# EAGLE design HB-WDS100-C6-O-2_Main_v2p0 (EAGLE 8.7.1)
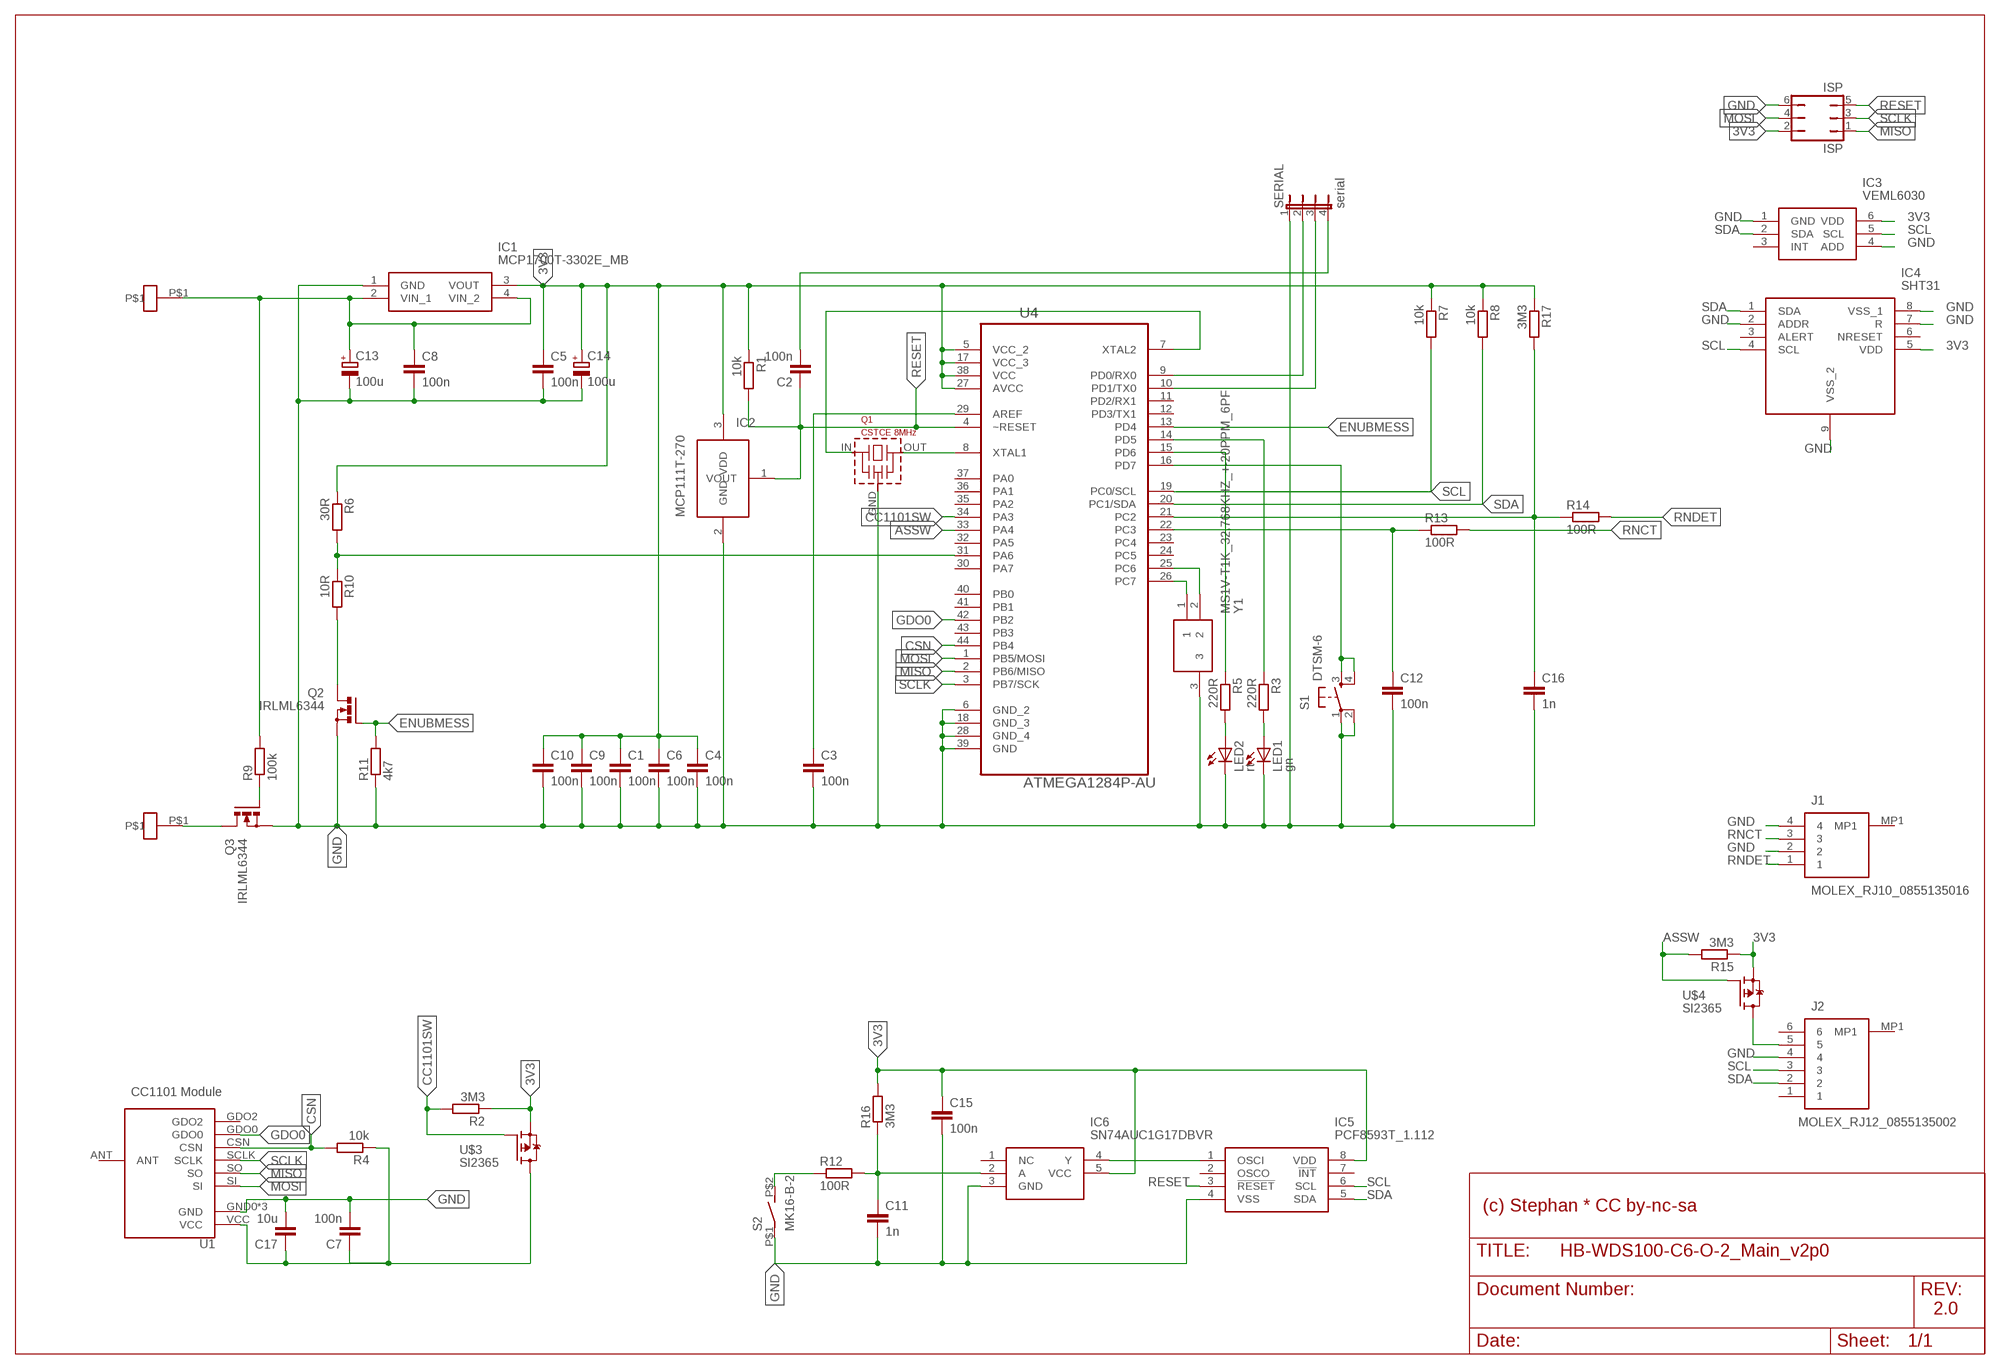
[diagram p0: schematic, sheet 1]

## Parts
C1  100n  C-EUC0805K  [C0805K]
C2  100n  C-EUC0805K  [C0805K]
C3  100n  C-EUC0805K  [C0805K]
C4  100n  C-EUC0805K  [C0805K]
C5  100n  C-EUC0805K  [C0805K]
C6  100n  C-EUC0805K  [C0805K]
C7  100n  C-EUC0805K  [C0805K]
C8  100n  C-EUC0805K  [C0805K]
C9  100n  C-EUC0805K  [C0805K]
C10  100n  C-EUC0805K  [C0805K]
C11  1n  C-EUC0805K  [C0805K]
C12  100n  C-EUC0805K  [C0805K]
C13  100u  CPOL-EUCT3528  [CT3528]
C14  100u  CPOL-EUCT3528  [CT3528]
C15  100n  C-EUC0805K  [C0805K]
C16  1n  C-EUC0805K  [C0805K]
C17  10u  C-EUC0805K  [C0805K]
IC1  MCP1700T-3302E_MB  [MCP1700T-3302E/MB]
IC2  MCP111-270  MCP111T  [SOT23]
IC3  VEML6030  VEML6030-HANDSOLD  [VEML6030-HANDSOLD]
IC4  SHT31  SHT31-HANDSOLD  [SON50P250X250X90-9N-HANDSOLD]
IC5  PCF8593T_1.112  [SOIC127P600X175-8N]
IC6  SN74AUC1G17DBVR  [SOT95P280X145-5N]
ISP  ISP  JP3Q  [JP3Q]
J1  MOLEX_RJ10_0855135016  [MOLEX_RJ10_0855135016]
J2  MOLEX_RJ12_0855135002  [MOLEX_RJ12_0855135002]
LED1  gn  LEDCHIPLED_0805  [CHIPLED_0805]
LED2  rt  LEDCHIPLED_0805  [CHIPLED_0805]
Q1  CSTCE 8MHz  CSTCE  [CSTCE]
Q2  IRLML6344  [SOT-23]
Q3  IRLML6344  [SOT-23]
R1  10k  R-EU_R0805W  [R0805W]
R2  3M3  R-EU_R0805W  [R0805W]
R3  220R  R-EU_R0805W  [R0805W]
R4  10k  R-EU_R0805W  [R0805W]
R5  220R  R-EU_R0805W  [R0805W]
R6  30R  R-EU_R0805W  [R0805W]
R7  10k  R-EU_R0805W  [R0805W]
R8  10k  R-EU_R0805W  [R0805W]
R9  100k  R-EU_R0805W  [R0805W]
R10  10R  R-EU_R0805W  [R0805W]
R11  4k7  R-EU_R0805W  [R0805W]
R12  100R  R-EU_R0805W  [R0805W]
R13  100R  R-EU_R0805W  [R0805W]
R14  100R  R-EU_R0805W  [R0805W]
R15  3M3  R-EU_R0805W  [R0805W]
R16  3M3  R-EU_R0805W  [R0805W]
R17  3M3  R-EU_R0805W  [R0805W]
S1  DTSM-6  [DTSM-6]
S2  MK16-B-2  [MK16-B-2]
SERIAL  serial  JP4E  [JP4]
U1  CC1101CC1101-SMD-2MM  [CC1101-SMD2MM]
U4  ATMEGA1284P-AU  [QFP80P1200X1200X120-44N]
U$1  LOETOESE  [LOETOESE]
U$2  LOETOESE  [LOETOESE]
U$3  SI2365  SI2323  [SOT23]
U$4  SI2365  SI2323  [SOT23]
Y1  MS1V-T1K_32.768KHZ_+-20PPM_6PF  [MS1VT1K32768KHZ20PPM6PF]

## Nets
3V3: C1.1 C4.1 C5.1 C6.1 C9.1 C10.1 C14.+ C15.1 IC1.3(VOUT) IC2.3(VDD) IC3.6(VDD) IC4.5(VDD) IC5.8(VDD) IC6.5(VCC) ISP.2 R1.1 R2.1 R6.1 R7.1 R8.1 R15.1 R16.2 R17.1 U4.5(VCC_2) U4.17(VCC_3) U4.27(AVCC) U4.38(VCC) U$3.2(S) U$4.2(S)
3V3AS5600: J2.5 U$4.3(D)
3V3CC1101: C7.1 C17.1 R4.1 U1.VCC U$3.3(D)
AREF: C3.1 U4.29(AREF)
ASSW: R15.2 U4.33(PA4) U$4.1(G)
BATTMINUS: Q3.P3(D) U$2.P$1
CC1101SW: R2.2 U4.34(PA3) U$3.1(G)
CSN: R4.2 U1.CSN U4.44(PB4)
ENUBMESS: Q2.P1(G) R11.2 U4.13(PD4)
GDO0: U1.GDO0 U4.42(PB2)
GND: C1.2 C3.2 C4.2 C5.2 C6.2 C7.2 C8.2 C9.2 C10.2 C11.2 C12.2 C13.- C14.- C15.2 C16.2 C17.2 IC1.1(GND) IC2.2(GND) IC3.1(GND) IC3.4(ADD) IC4.2(ADDR) IC4.7(R) IC4.8(VSS_1) IC4.9(VSS_2) IC5.4(VSS) IC6.3(GND) ISP.6 J1.2 J1.4 J2.4 LED1.C LED2.C Q1.GND Q2.P2(S) Q3.P2(S) R11.1 S1.1 S1.2 S2.P$1(P) SERIAL.1 U1.GND0(GND) U1.GND1(GND) U1.GND2(GND) U4.6(GND_2) U4.18(GND_3) U4.28(GND_4) U4.39(GND) Y1.3
LED1: LED1.A R3.2
LED1R: R3.1 U4.14(PD5)
LED2: LED2.A R5.2
LED2R: R5.1 U4.15(PD6)
MISO: ISP.1 U1.SO U4.2(PB6/MISO)
MOSI: ISP.4 U1.SI U4.1(PB5/MOSI)
OSC1: U4.25(PC6) Y1.2
OSC2: U4.26(PC7) Y1.1
PCFIN: IC5.1(OSCI) IC6.4(Y)
Q3GATE: Q3.P1(G) R9.1
REEDSW: R12.1 S2.P$2(S)
RESET: C2.1 IC2.1(VOUT) IC5.3(!RESET) ISP.5 R1.2 U4.4(~RESET)
RNCT: J1.3 R13.2
RNCTPIN: C12.1 R13.1 U4.22(PC3)
RNDET: J1.1 R14.2
RNDETPIN: C16.1 R14.1 R17.2 U4.21(PC2)
RX: SERIAL.2 U4.9(PD0/RX0)
SCL: IC3.5(SCL) IC4.4(SCL) IC5.6(SCL) J2.3 R7.2 U4.19(PC0/SCL)
SCLK: ISP.3 U1.SCLK U4.3(PB7/SCK)
SDA: IC3.2(SDA) IC4.1(SDA) IC5.5(SDA) J2.2 R8.2 U4.20(PC1/SDA)
SERIALRESET: C2.2 SERIAL.4
STIN: C11.1 IC6.2(A) R12.2 R16.1
SW1: S1.3 S1.4 U4.16(PD7)
TX: SERIAL.3 U4.10(PD1/TX0)
UBATT: C8.1 C13.+ IC1.2(VIN_1) IC1.4(VIN_2) R9.2 U$1.P$1
UBMESS: R6.2 R10.1 U4.31(PA6)
VOLTDEVFOOT: Q2.P3(D) R10.2
XTAL1: Q1.OUT U4.8(XTAL1)
XTAL2: Q1.IN U4.7(XTAL2)
Unconnected: IC3.3(INT) IC4.3(ALERT) IC4.6(NRESET) IC5.2(OSCO) IC5.7(!INT) IC6.1(NC) J1.MP1 J2.1 J2.6 J2.MP1 U1.ANT U1.GDO2 U4.11(PD2/RX1) U4.12(PD3/TX1) U4.23(PC4) U4.24(PC5) U4.30(PA7) U4.32(PA5) U4.35(PA2) U4.36(PA1) U4.37(PA0) U4.40(PB0) U4.41(PB1) U4.43(PB3)

## Notes on the sheet
- MCP111T-270
- CC1101 Module
- (c) Stephan * CC by-nc-sa
- 2.0

## Library data of the parts
C1-C4 C6 C7 C9-C12 C15-C17 = resistor:C-EU: CAPACITOR, European symbol
C5 C8 = rcl:C-EU: CAPACITOR, European symbol; SPICEPREFIX: C
C13 C14 = rcl:CPOL-EU: POLARIZED CAPACITOR, European symbol; SPICEPREFIX: C
IC1 = SamacSys_Parts:MCP1700T-3302E_MB: LDO voltage regulator 250mA Isupply 1uA Source: Datasheet <http://ww1.microchip.com/downloads/en/DeviceDoc/20001826C.pdf>; ARROW_PART_NUMBER: MCP1700T-3302E/MB; ARROW_PRICE-STOCK: https://www.arrow.com/en/products/mcp1700t-3302emb/microchip-technology; DESCRIPTION: LDO voltage regulator 250mA Isupply 1uA; HEIGHT: mm; MANUFACTURER_NAME: Microchip; MANUFACTURER_PART_NUMBER: MCP1700T-3302E/MB; MOUSER_PART_NUMBER: 579-MCP1700T3302E/MB; MOUSER_PRICE-STOCK: https://www.mouser.co.uk/ProductDetail/Microchip-Technology/MCP1700T-3302E-MB/?qs=WWgnj3qycfnlJJhwyn%2Fifw%3D%3D
IC2 = StephansLib:MCP111T
IC3 = StephansLib:VEML6030-HANDSOLD: VEML6030 Vishay, Ambient Light Sensor, Ambient Light to Digital Data I2C 6-Pin Source: Datasheet <https://www.vishay.com/docs/84366/veml6030.pdf>; ARROW_PART_NUMBER: VEML6030; ARROW_PRICE-STOCK: https://www.arrow.com/en/products/veml6030/vishay; DESCRIPTION: VEML6030 Vishay, Ambient Light Sensor, Ambient Light to Digital Data I2C 6-Pin; HEIGHT: 0.87mm; MANUFACTURER_NAME: Vishay; MANUFACTURER_PART_NUMBER: VEML6030; MOUSER_PART_NUMBER: 78-VEML6030; MOUSER_PRICE-STOCK: https://www.mouser.co.uk/ProductDetail/Vishay-Semiconductors/VEML6030?qs=oeTp6q%252Bm7GMZCCnCKRrv4g%3D%3D
IC4 = StephansLib:SHT31-HANDSOLD: Board Mount Humidity Sensors SHT3x Humidity and Temperature Sensor Source: Datasheet <https://componentsearchengine.com/Datasheets/1/SHT31-DIS-F2.5kS.pdf>; ARROW_PART_NUMBER: SHT31-DIS-F2.5KS; ARROW_PRICE-STOCK: https://www.arrow.com/en/products/sht31-dis-f2.5ks/sensirion-ag; DESCRIPTION: Board Mount Humidity Sensors SHT3x Humidity and Temperature Sensor; HEIGHT: 0.9mm; MANUFACTURER_NAME: Sensirion; MANUFACTURER_PART_NUMBER: SHT31-DIS-F2.5kS; MOUSER_PART_NUMBER: 403-SHT31-DIS-F; MOUSER_PRICE-STOCK: https://www.mouser.co.uk/ProductDetail/Sensirion/SHT31-DIS-F25kS?qs=SiS427jF8nOsxbyIRpupXg%3D%3D
IC5 = SamacSys_Parts:PCF8593T_1.112: NXP - PCF8593T/1.112 - IC, RTC/CALENDAR, SMD, 8593, SOIC8 Source: Datasheet <http://www.farnell.com/datasheets/1245502.pdf>; DESCRIPTION: NXP - PCF8593T/1.112 - IC, RTC/CALENDAR, SMD, 8593, SOIC8; HEIGHT: 1.75mm; MANUFACTURER_NAME: Nexperia; MANUFACTURER_PART_NUMBER: PCF8593T/1.112
IC6 = SamacSys_Parts:SN74AUC1G17DBVR: Single Schmitt-Trigger Buffer Source: Datasheet <http://www.ti.com/lit/gpn/sn74auc1g17>; ARROW_PART_NUMBER: SN74AUC1G17DBVR; ARROW_PRICE-STOCK: https://www.arrow.com/en/products/sn74auc1g17dbvr/texas-instruments; DESCRIPTION: Single Schmitt-Trigger Buffer; HEIGHT: 1.45mm; MANUFACTURER_NAME: Texas Instruments; MANUFACTURER_PART_NUMBER: SN74AUC1G17DBVR; MOUSER_PART_NUMBER: 595-SN74AUC1G17DBVR; MOUSER_PRICE-STOCK: https://www.mouser.com/Search/Refine.aspx?Keyword=595-SN74AUC1G17DBVR
ISP = jumper:JP3Q: JUMPER
J1 = StephansLib:MOLEX_RJ10_0855135016
J2 = StephansLib:MOLEX_RJ12_0855135002: CONN MOD JACK 6P6C VERT UNSHLD Source: Datasheet <https://www.molex.com/pdm_docs/sd/855135002_sd.pdf>; ARROW_PART_NUMBER: 0855135002; ARROW_PRICE-STOCK: https://www.arrow.com/en/products/0855135002/molex; DESCRIPTION: CONN MOD JACK 6P6C VERT UNSHLD; HEIGHT: 12.85mm; MANUFACTURER_NAME: Molex; MANUFACTURER_PART_NUMBER: 0855135002
LED1 LED2 = led:LED: LED OSRAM: - CHIPLED LG R971, LG N971, LY N971, LG Q971, LY Q971, LO R971, LY R971 LH N974, LH R974 LS Q976, LO Q976, LY Q976 LO Q996 - Hyper CHIPLED LW Q18S LB Q993, LB Q99A, LB R99A - SideLED LS A670, LO A670, LY A670, LG A670, LP A670 LB A673, LV A673, LT A673, LW A673 LH A674 LY A675 LS A676, LA A676, LO A676, LY A676, LW A676 LS A679, LY A679, LG A679 - Hyper Micro SIDELED® LS Y876, LA Y876, LO Y876, LY Y876 LT Y87S - SmartLED LW L88C, LW L88S LB L89C, LB L89S, LG L890 LS L89K, LO L89K, LY L89K LS L896, LA L896, LO L896, LY L896 - TOPLED LS T670, LO T670, LY T670, LG T670, LP T670 LSG T670, LSP T670, LSY T670, LOP T670, LYG T670 LG T671, LOG T671, LSG T671 LB T673, LV T673, LT T673, LW T673 LH T674 LS T676, LA T676, LO T676, LY T676, LB T676, LH T676, LSB T676, LW T676 LB T67C, LV T67C, LT T67C, LS T67K, LO T67K, LY T67K, LW E67C LS E67B, LA E67B, LO E67B, LY E67B, LB E67C, LV E67C, LT E67C LW T67C LS T679, LY T679, LG T679 LS T770, LO T770, LY T770, LG T770, LP T770 LB T773, LV T773, LT T773, LW T773 LH T774 LS E675, LA E675, LY E675, LS T675 LS T776, LA T776, LO T776, LY T776, LB T776 LHGB T686 LT T68C, LB T68C - Hyper Mini TOPLED® LB M676 - Mini TOPLED Santana® LG M470 LS M47K, LO M47K, LY M47K Source: http://www.osram.convergy.de LUXEON: - LUMILED® LXK2-PW12-R00, LXK2-PW12-S00, LXK2-PW14-U00, LXK2-PW14-V00 LXK2-PM12-R00, LXK2-PM12-S00, LXK2-PM14-U00 LXK2-PE12-Q00, LXK2-PE12-R00, LXK2-PE12-S00, LXK2-PE14-T00, LXK2-PE14-U00 LXK2-PB12-K00, LXK2-PB12-L00, LXK2-PB12-M00, LXK2-PB14-N00, LXK2-PB14-P00, LXK2-PB14-Q00 LXK2-PR12-L00, LXK2-PR12-M00, LXK2-PR14-Q00, LXK2-PR14-R00 LXK2-PD12-Q00, LXK2-PD12-R00, LXK2-PD12-S00 LXK2-PH12-R00, LXK2-PH12-S00 LXK2-PL12-P00, LXK2-PL12-Q00, LXK2-PL12-R00 Source: www.luxeon.com KINGBRIGHT: KA-3528ASYC Source: www.kingbright.com
Q1 = murata-cstcc-cstce-cstcr-cstcv-resonators:CSTCE: Murata CSTCE Resonator - 3,2 x 1,3 mm
Q2 Q3 = mosfet:IRLML6344: Nch MOSFET IRLML6344 30V 5A http://akizukidenshi.com/catalog/g/gI-06049/ I-06049
R1-R17 = resistor:R-EU_: RESISTOR, European symbol
S1 = switches:DTSM-6
S2 = StephansLib:MK16-B-2: Meder Reed Switch
SERIAL = jumper:JP4E: JUMPER
U1 = modules:CC1101
U4 = Atmel_By_element14_Batch_1-00:ATMEGA1284P-AU: Microcontroller with Programmable Flash; MPN: ATMEGA1284P-AU; OC_FARNELL: 1715480; OC_NEWARK: 15R0263; PACKAGE: TQFP-44; SUPPLIER: Atmel
U$1 U$2 = StephansLib:LOETOESE: single solder pin
U$3 U$4 = StephansLib:SI2323: Si2323 p-channel MOSFET
Y1 = SamacSys_Parts:MS1V-T1K_32.768KHZ_+-20PPM_6PF: CRYSTAL, SMD, MET, 32.768KHZ 6.0; Frequency Nom:32.768kHz; Crystal Case:Cylinder SMD, 6.1mm x 2mm Dia; Frequency Stability + / -:-; Load Capacitance:6pF; Frequency Tolerance + / -:20ppm; Product Range:MS1V-T1K Series; Operating RoHS Compliant: Yes Source: Datasheet <https://componentsearchengine.com/Datasheets/2/MS1V-T1K 32.768KHZ -20PPM 6PF.pdf>; DESCRIPTION: CRYSTAL, SMD, MET, 32.768KHZ 6.0; Frequency Nom:32.768kHz; Crystal Case:Cylinder SMD, 6.1mm x 2mm Dia; Frequency Stability + / -:-; Load Capacitance:6pF; Frequency Tolerance + / -:20ppm; Product Range:MS1V-T1K Series; Operating RoHS Compliant: Yes; HEIGHT: 2.08mm; MANUFACTURER_NAME: Micro Crystal AG; MANUFACTURER_PART_NUMBER: MS1V-T1K 32.768KHZ +-20PPM 6PF

## Board
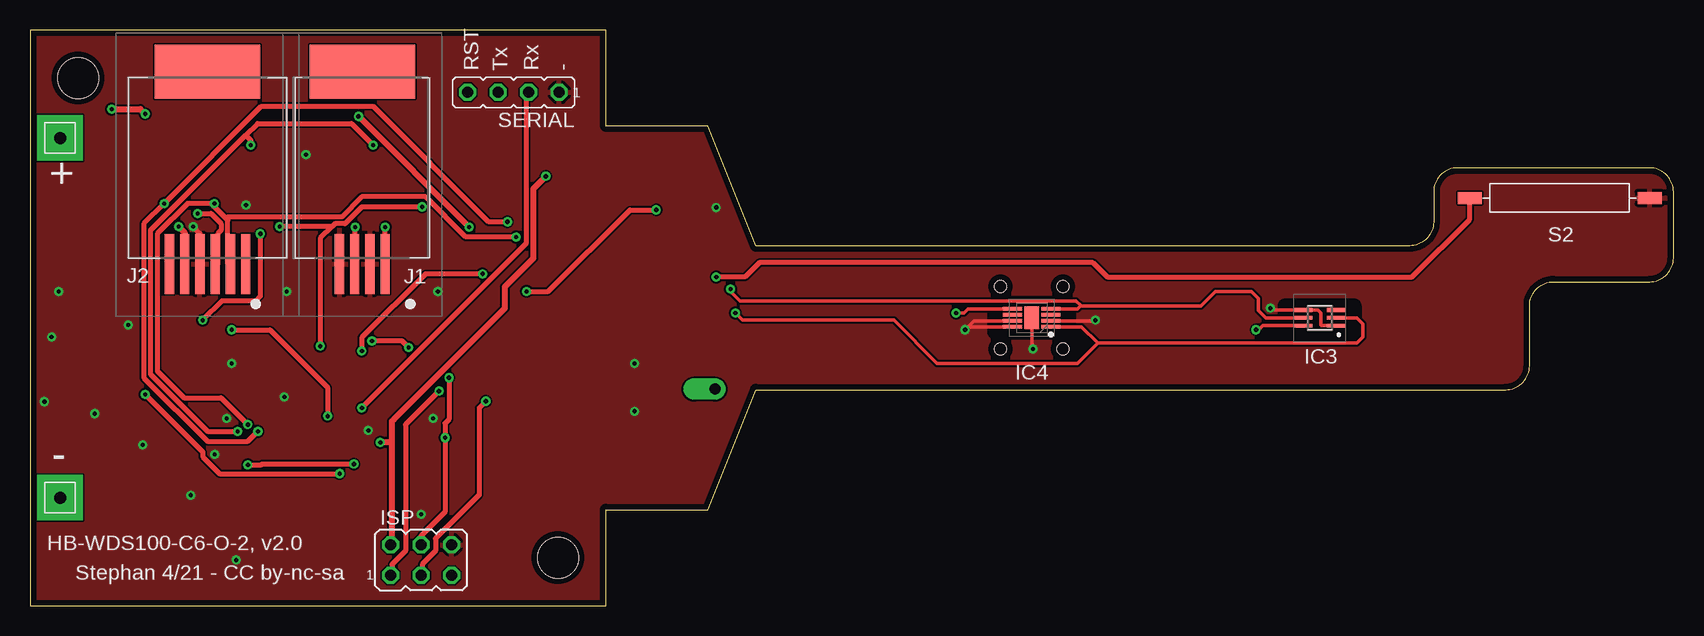
[diagram p1: board, top side]
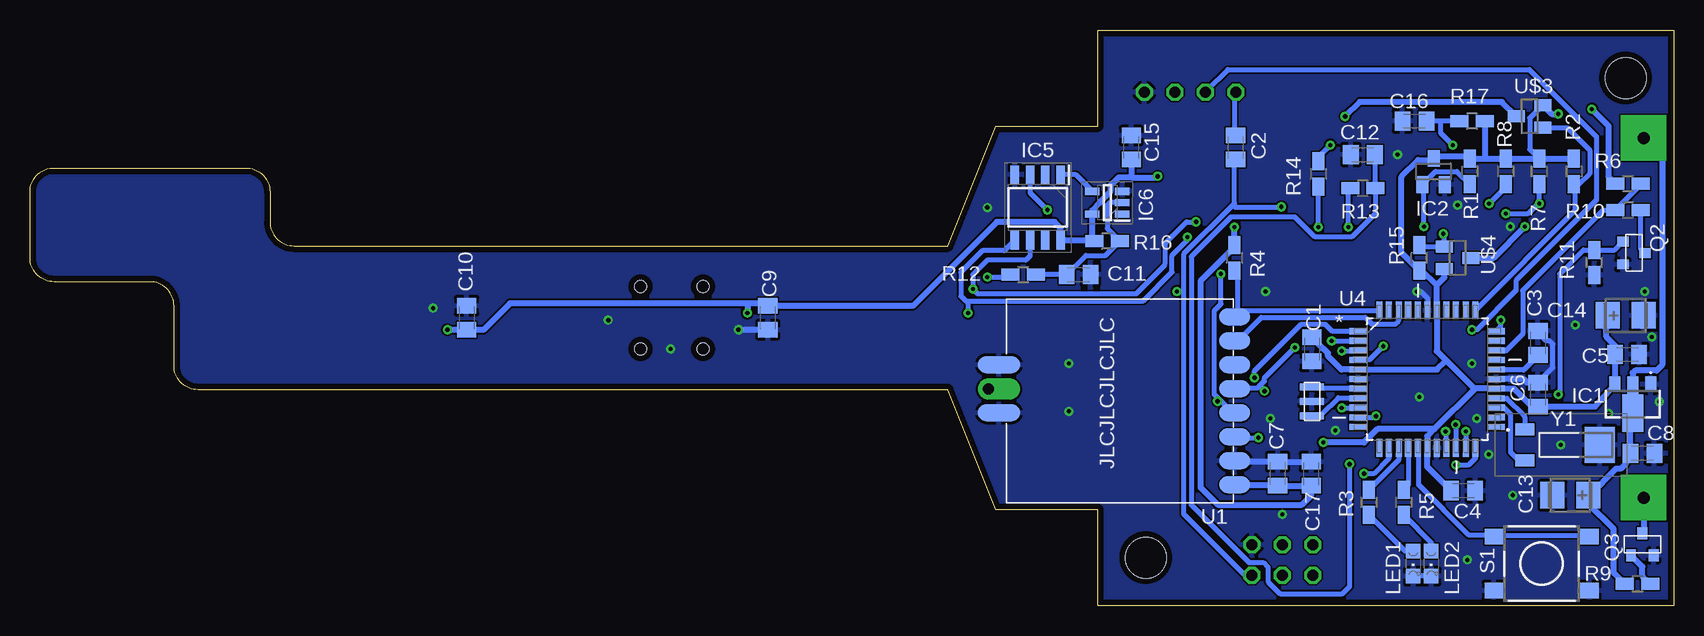
[diagram p2: board, bottom side, seen from below]

Size 137 x 48 mm. Coordinates in mm from the lower left corner, seen from the top.
Outline: 0,0 48,0 48,8 56.5,8 60.5,18 123,18 arc90 125,20 125,25 arc-90 127,27 135,27 arc90 137,29 137,34.5 arc90 135,36.5 119,36.5 arc90 117,34.5 117,32 arc-90 115,30 60.5,30 56.5,40 48,40 48,48 0,48 0,0
Copper layers (1*16): Top 0.035mm / dielectric 1.5mm / Bottom 0.035mm
Design rules "default *": minimum track width 11mil, minimum drill 0.35mm, track to track 6mil, track to pad 6mil, pad to pad 6mil, via to via 6mil, smd to smd 6mil, copper to edge 20mil, drill to drill 6mil, minimum pad ring 10mil, minimum via ring 8mil, stop-mask expansion 4mil, vias tented up to drill 0mil, thermal gap 10mil
Holes 3.4 mm at 4,44 44,4
Holes 1 mm at 80.9,21.4 86.1,21.4 86.1,26.6 80.9,26.6

### Footprints (pad centres in the part's own frame; a part is rotated, then mirrored left to right if it is on the bottom)
C0805K = smd 1.3 x 1.6: 1 -1,0; 2 1,0
CT3528 = smd 2 x 2.2: + -1.5,0; - 1.5,0
MCP1700T-3302E/MB = smd 0.9 x 1.3: 1 -1.5,-1.65; 3 1.5,-1.65 | smd 0.9 x 1.475: 2 0,-1.562 | smd 1.733 x 3.125: 4 0,0.738
SOT23 = smd 1 x 1.4: 1 -0.95,-1.1; 2 0.95,-1.1; 3 0,1.1
VEML6030-HANDSOLD = smd 1.6 x 0.3: 1 -1.4,0.65; 2 -1.4,0; 3 -1.4,-0.65; 4 1.4,-0.65; 5 1.4,0; 6 1.4,0.65
SON50P250X250X90-9N-HANDSOLD = smd 1.6 x 0.3: 1 -1.6,0.75; 2 -1.6,0.25; 3 -1.6,-0.25; 4 -1.6,-0.75; 5 1.6,-0.75; 6 1.6,-0.25; 7 1.6,0.25; 8 1.6,0.75 | smd 1.2 x 1.9: 9 0,0
SOIC127P600X175-8N = smd 1.55 x 0.7: 1 -2.725,1.905; 2 -2.725,0.635; 3 -2.725,-0.635; 4 -2.725,-1.905; 5 2.725,-1.905; 6 2.725,-0.635; 7 2.725,0.635; 8 2.725,1.905
SOT95P280X145-5N = smd 1.2 x 0.6: 1 -1.25,0.95; 2 -1.25,0; 3 -1.25,-0.95; 4 1.25,-0.95; 5 1.25,0.95
JP3Q = drill 0.914 octagon: 1 -2.54,-1.27; 2 -2.54,1.27; 3 0,-1.27; 4 0,1.27; 5 2.54,-1.27; 6 2.54,1.27
MOLEX_RJ10_0855135016 = smd 0.76 x 5: 1 1.905,-8.025; 2 0.635,-8.025; 3 -0.635,-8.025; 4 -1.905,-8.025 | smd 8.8 x 4.5: MP1 0,8.025
MOLEX_RJ12_0855135002 = smd 0.76 x 5: 1 3.175,-8.025; 2 1.905,-8.025; 3 0.635,-8.025; 4 -0.635,-8.025; 5 -1.905,-8.025; 6 -3.175,-8.025 | smd 8.8 x 4.5: MP1 0,8.025
CHIPLED_0805 = smd 1.2 x 1.2: A 0,-1.05; C 0,1.05
CSTCE = smd 0.6 x 2: GND 0,0; IN 1.2,0; OUT -1.2,0
SOT-23 = smd 0.802 x 0.972: P1 -0.95,-0.917; P2 0.95,-0.917; P3 0,0.917
R0805W = smd 1.5 x 1: 1 -1.052,0; 2 1.052,0
DTSM-6 = smd 1.55 x 1.3: 1 -3.975,2.25; 2 3.975,2.25; 3 -3.975,-2.25; 4 3.975,-2.25
MK16-B-2 = smd 2 x 1: P$1 -7.5,0; P$2 7.5,0
JP4 = drill 0.914 octagon: 1 -3.81,0; 2 -1.27,0; 3 1.27,0; 4 3.81,0
CC1101-SMD2MM = drill 0.9 pad 1.778 offset: ANT 10.965,-0.984 | smd 2.54 x 1.4: CSN -9.565,-7; GDO0 -9.565,-5; GDO2 -9.565,-3; GND0 -9.565,5; SCLK -9.565,1; SI -9.565,3; SO -9.565,-1; VCC -9.565,7 | smd 3.5 x 1.4: GND1 10.075,-3; GND2 10.075,1
QFP80P1200X1200X120-44N = smd 1.473 x 0.508: 1 -5.74,3.988; 2 -5.74,3.2; 3 -5.74,2.388; 4 -5.74,1.6; 5 -5.74,0.787; 6 -5.74,0; 7 -5.74,-0.787; 8 -5.74,-1.6; 9 -5.74,-2.388; 10 -5.74,-3.2; 11 -5.74,-3.988; 23 5.74,-3.988; 24 5.74,-3.2; 25 5.74,-2.388; 26 5.74,-1.6; 27 5.74,-0.787; 28 5.74,0; 29 5.74,0.787; 30 5.74,1.6; 31 5.74,2.388; 32 5.74,3.2; 33 5.74,3.988 | smd 0.508 x 1.473: 12 -3.988,-5.74; 13 -3.2,-5.74; 14 -2.388,-5.74; 15 -1.6,-5.74; 16 -0.787,-5.74; 17 0,-5.74; 18 0.787,-5.74; 19 1.6,-5.74; 20 2.388,-5.74; 21 3.2,-5.74; 22 3.988,-5.74; 34 3.988,5.74; 35 3.2,5.74; 36 2.388,5.74; 37 1.6,5.74; 38 0.787,5.74; 39 0,5.74; 40 -0.787,5.74; 41 -1.6,5.74; 42 -2.388,5.74; 43 -3.2,5.74; 44 -3.988,5.74
LOETOESE = drill 1 pad 3.81 square: P$1 0,0
MS1VT1K32768KHZ20PPM6PF = smd 1.6 x 1: 1 0.8,-1.3; 2 0.8,1.3 | smd 2.5 x 3: 3 -5.45,0

### Placement (x,y rotation side)
C1  30.14,21.37 270 bottom
C2  36.5,38.2 90 bottom
C3  11.3,21.9 90 bottom
C4  17.53,9.58 0 bottom
C5  3.86,20.94 0 bottom
C6  11.3,17.6 90 bottom
C7  33,11 90 bottom
C8  2.6,12.7 0 bottom
C9  75.5,24 270 bottom
C10  100.6,24 90 bottom
C11  49.6,27.6 0 bottom
C12  25.9,37.6 180 bottom
C13  8.6,9.2 180 bottom
C14  4,24.2 0 bottom
C15  45.2,38.2 90 bottom
C16  21.6,40.4 180 bottom
C17  30.2,11 90 bottom
IC1  3.4,16.8 180 bottom
IC2  20,36.2 0 bottom
IC3  107.5,24 180 top
IC4  83.5,24 180 top
IC5  53,33.2 270 bottom
IC6  47.2,33.6 180 bottom
ISP  32.6,3.8 0 top
J1  27.7,36.5 0 top
J2  14.8,36.5 0 top
LED1  21.7,3.5 180 bottom
LED2  20.2,3.5 180 bottom
Q1  30.13,17.02 90 bottom
Q2  3.3,29.4 270 bottom
Q3  2.6,5.1 0 bottom
R1  17,36.2 270 bottom
R2  8.3,36.2 270 bottom
R3  25.4,8.6 270 bottom
R4  36.6,29 270 bottom
R5  22.5,8.6 270 bottom
R6  3.79,35.19 0 bottom
R7  11.2,36.2 270 bottom
R8  14,36.2 270 bottom
R9  3,1.8 180 bottom
R10  3.8,33 0 bottom
R11  6.6,28.6 90 bottom
R12  54.2,27.6 0 bottom
R13  25.9,34.8 180 bottom
R14  29.6,36 270 bottom
R15  21.2,29 90 bottom
R16  47.2,30.4 180 bottom
R17  16.8,40.4 180 bottom
S1  11,3.5 180 bottom
S2  127.5,34 180 top
SERIAL  40.3,42.8 180 top
U1  46.15,17.07 180 bottom
U4  20.52,18.88 0 bottom
U$1  2.5,39 0 top
U$2  2.5,9 0 top
U$3  12,40.8 90 bottom
U$4  18,29 270 bottom
Y1  11.6,13.4 180 bottom

### Tracks (layer width: path | path; a pad name or v marks a point on that pad's centre or on a via)
3V3  (via drill 0.35)
  Top 0.305: IC3.6 102.75,23.35 102.4,23 v102.2,23 | IC4.5 78.19,24.75 77.84,24.4 v77.2,24.4
  Top 0.406: 30.18,15.37 30.32,15.51
  Top 0.508: 30.32,15.51 39.6,24.79 39.6,26.6 41.96,28.96 41.96,34.76 v43,35.8 | 30.18,13.6 30.18,5.31 ISP.2 | 30.18,13.6 30.18,15.37 | v6.8,41.4 9.2,41.4 v9.6,41 | 30.18,13.6 v29.2,13.6
  Bottom 0.406: 19.84,37.44 IC2.3 | 17.04,37.44 R1.1 16.76,37.16 | 18.44,9.5 C4.1 | 11.46,16.76 C6.1 | 75.72,24.87 C9.1 | U$3.2 12,40.65 12,38.05 R7.1
  Bottom 0.508: 17.04,37.44 19.84,37.44 | 20.12,37.16 21.28,37.16 22.67,35.76 22.67,29.42 R15.1 20.96,27.95 19.74,26.72 | 20.12,37.16 IC2.3 | R1.1 15.6,37.25 | 15.6,37.25 R8.1 R7.1 R2.1 | 19.74,26.72 U4.38 19.74,21.23 18.95,20.45 | R6.1 5.4,35.75 5.4,40 v6.8,41.4 | U$3.2 10.15,41 v9.6,41 | C4.1 20.52,11.58 U4.17 20.52,14.11 19.92,14.72 | C1.1 30.14,22.34 29.23,21.43 29.17,21.43 28.8,21.06 28.8,20.8 27.67,19.67 U4.5 19.73,19.67 18.95,20.45 | C14.+ 5.6,24.1 5.6,22.4 4.86,21.66 C5.1 4.86,18.89 IC1.3 6.55,16.6 C6.1 | 16.54,18.1 U4.27 14.76,18.1 14.65,18.08 14.62,18.1 13.3,18.1 11.96,16.76 11.46,16.76 | 16.54,18.1 19.92,14.72 | 45.2,35.7 43.09,35.7 v43,35.8 | C15.1 45.2,35.7 | 19.74,26.72 19.1,27.36 U$4.2 | 19.92,14.72 24.68,14.72 25.8,13.6 v29.2,13.6 | 18.95,20.45 16.61,18.1 16.54,18.1 | 19.95,37.33 20.12,37.16 | R17.1 15.75,37.4 15.6,37.25 | 45.2,35.7 46.27,35.7 46.96,35.02 46.96,34.51 47.81,33.65 47.81,33.59 48.45,32.95 IC6.5 48.45,30.6 R16.2 48.33,30.48 IC5.8 51.09,31.5 51.6,32 56.4,32 63.4,25 C9.1 75.7,25.2 77.2,25.2 | v102.2,23 C10.1 99.2,23 97,25.2 77.2,25.2 | 77.2,25.2 v77.2,24.4
3V3AS5600  (via drill 0.35)
  Top 0.508: v12.4,31.6 12.89,31.11 J2.5
  Bottom 0.508: U$4.3 15,29 v12.4,31.6
3V3CC1101  (via drill 0.35)
  Top 0.508: v36.6,31.57 v27.38,40.79
  Bottom 0.406: 33.25,10.06 C7.1 | 36.32,10.06 U1.VCC 36.6,10.34 37.44,10.34 | 13.13,40.79 U$3.3 | 36.6,30.18 R4.1 36.6,29.9
  Bottom 0.508: 36.32,10.06 33.25,10.06 | 36.6,30.18 v36.6,31.57 | 36.6,29.9 39.44,27.06 39.44,9.84 38,8.4 31,8.4 30.2,9.2 C17.1 C7.1 | U$3.3 14.3,42 26.17,42 v27.38,40.79 | 36.72,10.2 U1.VCC
AREF
  Bottom 0.406: U4.29 14.53,19.64 12.49,19.64 11.46,20.68 C3.1
ASSW  (via drill 0.35)
  Top 0.406: v19.2,31 19.2,25.8 18.8,25.4 16,25.4 v14.4,23.8
  Bottom 0.406: R15.2 21.1,29.95 U$4.1 19.1,30.9 v19.2,31 | U4.33 14.4,23.26 v14.4,23.8
BATTMINUS
  Bottom 0.508: U$2.P$1 2.5,6.12 Q3.P3
CC1101SW
  Bottom 0.406: U$3.1 8.85,39.85 7,38 7,36 7.85,35.15 8.2,35.15 | 8.2,35.15 R2.2 | U4.34 8.2,32.96 8.2,35.15
CSN
  Bottom 0.406: U4.44 24.59,24.59 36.04,24.59 36.32,24.31 U1.CSN 36.32,24.59 36.32,27.94 R4.2
ENUBMESS  (via drill 0.35)
  Top 0.406: v25.8,11 15.8,11 14.4,12.4 14.4,12.8 v9.6,17.6
  Bottom 0.406: Q2.P1 4.92,29.65 R11.2 7.51,29.65 9.5,27.66 9.5,17.7 v9.6,17.6 | U4.13 23.73,12.28 25,11 v25.8,11
GDO0
  Bottom 0.406: U4.42 22.91,24.59 22.91,23.75 23.19,23.47 25.15,23.47 25.7,24.03 34.37,24.03 36.32,22.07 U1.GDO0
GND  (via drill 0.35)
  Top 0.305: IC4.8 78.2,23.25 v77.95,23 78.7,23.75 IC4.7 | IC3.1 107.65,23.35 107.6,23.4 107.6,24.4 107.35,24.65 IC3.4 103.55,24.65 v103.4,24.8 | IC4.2 88.75,23.75 v88.8,23.8 | IC4.9 83.5,21.5 v83.6,21.4
  Top 0.406: 83.25,23.25 83.5,23.5 IC4.9 | 83.75,23.75 IC4.9 | 14.25,30.73 14.25,28.5 J2.4 14.16,31.04 v13.6,31.6 | IC4.9 83.54,24.03 83.45,23.95
  Bottom 0.381: 7,1.25 S1.1
  Bottom 0.406: 15.09,1.4 S1.2 14.81,1.4 | 20.12,2.23 LED2.C 20.4,2.52 21.51,2.52 LED1.C 21.79,2.52 | 6.99,1.4 S1.1 7.26,1.4 | 56.16,20.12 U1.GND1 | 55.32,16.2 56.16,16.2 U1.GND2 | 55.6,20.4 U1.GND1 | U4.39 20.48,24.67 20.48,25.6 21.08,26.2 v21.4,26.2 | 26.82,37.16 C12.2 26.99,37.4 27.1,37.16 | 11.73,19 11.46,18.72 C6.2 11.18,18.72 10.06,19.84 10.06,21.79 10.34,22.07 10.62,22.07 11.18,22.63 C3.2 | 29.9,20.12 C1.2 30.18,20.12 | 30.18,17.04 Q1.GND | 33.25,12.01 C7.2 | 36.32,12.01 U1.GND0 36.6,12.01 | 19,34.92 IC2.2 | 56.44,20.12 U1.GND1 | 75.44,22.91 C9.2
  Bottom 0.508: C9.2 v77.95,23 | 36.32,12.01 33.25,12.01 | C6.2 12.2,18.6 12.48,18.88 U4.28 | C7.2 C17.2
  other vias: 16.8,20.2 28.2,14.6 15.4,12.6 8.2,23.4 1.8,22.4 1.2,17 2.4,26.2 5.4,16 23,37.6 18,33.4 16.4,15.6 33.6,15.6 32.6,7.6 34,26.2 50.4,20.2 50.4,16.2 9.4,13.4 13.4,9.2 17.2,3.8 21.2,17.4 57.2,33.2
  pour Top: 0,0 0,48 137.5,48 137.5,0
  pour Bottom: -1,49.4 139,49.4 139.2,49.2 139.8,48.6 139.8,-1.6 -1.4,-1.6 -1.4,49.2 -1.2,49.4
LED1
  Bottom 0.406: R3.2 22.4,4.55 LED1.A
LED1R
  Bottom 0.406: U4.14 22.91,12.14 R3.1
LED2
  Bottom 0.406: R5.2 20.2,5.25 LED2.A
LED2R
  Bottom 0.406: U4.15 22.12,10.03 R5.1
MISO  (via drill 0.35)
  Top 0.406: v28.5,22.07 31.01,22.07 v31.57,21.51 | v34.09,17.88 31.29,15.09 31.29,4.55 30.18,3.43 30.18,2.65 ISP.1
  Bottom 0.406: v28.5,22.07 26.54,22.07 U4.2 | v31.57,21.51 34.09,19 34.09,18.72 34.51,18.3 | 34.51,18.3 34.65,18.16 36.32,18.16 U1.SO | 34.51,18.3 v34.09,17.88
MOSI  (via drill 0.35)
  Top 0.406: v34.92,19 34.92,15.53 34.6,15.2 v34.6,14 34.6,7.8 32.6,5.8 ISP.4
  Bottom 0.406: v34.92,19 34.92,19.56 31.01,23.47 29.06,23.47 28.5,22.91 26.54,22.91 U4.1 | 36.32,13.97 36.42,14.07 U1.SI 36.52,14 v34.6,14
N$1
  cutout Top: 80.44,22.2 86.56,22.2 arc90 87.2,22.84 87.2,25.16 arc90 86.56,25.8 80.44,25.8 arc90 79.8,25.16 79.8,22.84 arc90
N$2
  cutout Top: 104.64,25.6 110.36,25.6 arc-90 111,24.96 111,22.65 arc-90 110.75,22.4 104.64,22.4 arc-90 104,23.04 104,24.96 arc-90
OSC1
  Bottom 0.406: U4.25 14.1,16.5 13.6,16 13.6,12.8 12.9,12.1 Y1.2
OSC2
  Bottom 0.406: U4.26 13.88,17.28 12.46,15.86 12.46,15.8 12.4,15.75 Y1.1
PCFIN
  Bottom 0.406: IC6.4 49.83,35.92 IC5.1
Q3GATE
  Bottom 0.508: R9.1 2.6,2.45 2.6,3.23 Q3.P1
REEDSW  (via drill 0.35)
  Top 0.406: S2.P$2 120,32.2 115.2,27.4 89.8,27.4 88.6,28.6 60.8,28.6 59.6,27.4 v57.2,27.4
  Bottom 0.406: v57.2,27.4 55.45,27.4 R12.1
RESET  (via drill 0.35)
  Top 0.406: v32.69,33.25 27.66,33.25 26.26,31.85 25.43,31.85 25.17,31.6 | 25.17,31.6 v20.8,31.6 | 25.17,31.6 24.2,30.63 v24.2,21.64 v24.19,21.63 | v41.4,26.2 43.2,26.2 50,33 v52.2,33
  Bottom 0.406: 20.68,34.92 IC2.1 | 16.76,34.92 R1.2 18.05,36.2 19.85,36.2 IC2.1 | 36.74,33.39 40.83,29.3 40.83,26.2 | 36.74,33.39 36.6,33.53 36.6,37.16 C2.1 | v32.69,33.25 36.6,33.25 36.74,33.39 | IC2.1 20.8,34.95 v20.8,31.6 | ISP.5 35.73,2.53 40.83,7.63 40.83,26.2 | 40.83,26.2 v41.4,26.2 | v24.19,21.63 25.34,20.48 U4.4 | IC5.3 53.63,34.44 v52.2,33
RNCT  (via drill 0.35)
  Top 0.406: v27.1,31.57 27.1,28.5 J1.3
  Bottom 0.406: v27.1,31.57 27.1,34.65 R13.2
RNCTPIN  (via drill 0.35)
  Top 0.406: v18.16,11.73 19.28,11.73 19.34,11.8 v27,11.8
  Bottom 0.406: v18.16,11.73 17.04,11.73 16.48,12.29 16.48,13.13 U4.22 | R13.1 24.87,34.65 24.87,32.69 26.82,30.73 29.9,30.73 31.57,32.41 36.88,32.41 40.2,29.1 40.2,8.39 35.4,3.6 34.2,3.6 33.8,3.2 33.8,2 32.8,1 27.6,1 27,1.6 v27,11.8 | 24.87,34.92 R13.1 | R13.1 24.85,37.55 C12.1
RNDET  (via drill 0.35)
  Top 0.406: v29.62,31.57 29.62,28.5 J1.1
  Bottom 0.406: v29.62,31.57 29.62,34.92 R14.2
RNDETPIN  (via drill 0.35)
  Top 0.406: v17.32,14.53 14.81,14.53 10.06,19.28 10.06,31.29 17.98,39.22 | v28.6,38.4 26.8,40.2 18.97,40.2 17.98,39.22 | 17.98,39.22 18.4,38.8 v18.4,38.4
  Bottom 0.406: v17.32,14.53 17.32,13.41 U4.21 | v28.6,38.4 29.6,37.4 R14.1 | R17.2 19.4,40.4 | 19.4,40.4 C16.1 | v18.4,38.4 19.4,39.4 19.4,40.4
RX  (via drill 0.35)
  Top 0.406: v27.66,16.48 41.35,30.18 41.35,42.75 SERIAL.2
  Bottom 0.406: v27.66,16.48 26.54,16.48 U4.9
SCL  (via drill 0.35)
  Top 0.305: 85.05,24.75 IC4.4 87.3,24.75 87.55,25 | v58.4,26.4 58.4,26.2 59.2,25.4 87.2,25.4 87.55,25.05 87.55,25 | IC3.5 103,24 102.4,24.6 102.4,25.6 101.8,26.2 98.8,26.2 97.6,25 87.55,25
  Top 0.406: v13.97,32.69 15.09,32.69 15.93,31.85 15.93,31.29 15.65,31.01 15.65,28.5 J2.3 | v19,14.53 18.16,13.69 14.81,13.69 9.5,19 9.5,31.85 v11.18,33.53 19.28,41.63 28.6,41.63 38.23,32 v39.8,32
  Bottom 0.406: v13.97,32.69 12.11,32.69 11.22,33.58 | 11.22,33.58 11.2,33.6 R7.2 | v19,14.53 19,13.41 U4.19 | v11.18,33.53 11.22,33.58 | v39.8,32 40.6,32 42.36,30.24 42.36,28.6 42.4,28.4 44.8,26 58,26 v58.4,26.4 58.4,27.6 57.2,28.8 54,28.8 53.63,29.16 IC5.6
SCLK  (via drill 0.35)
  Top 0.406: v27.66,21.23 27.66,22.35 32.97,27.66 v37.72,27.66 | v38,17.04 37.44,16.48 37.44,9.22 33.81,5.59 33.81,4.55 32.69,3.43 32.69,2.62 ISP.3
  Bottom 0.406: v27.66,21.23 26.54,21.23 U4.3 | v37.72,27.66 37.72,25.15 38.28,24.59 38.28,17.6 37.86,17.18 | 37.86,17.18 36.6,15.93 U1.SCLK | v38,17.04 37.86,17.18
SDA  (via drill 0.35)
  Top 0.305: 89,21.9 110.6,21.9 111.1,22.4 111.1,23.5 110.6,24 IC3.2 | v58.8,24.4 59.4,23.8 72,23.8 75.6,20.2 87.3,20.2 89,21.9 | 89,21.9 87.65,23.25 IC4.1
  Top 0.406: v18.16,15.09 15.93,17.32 12.85,17.32 10.62,19.56 10.62,31.01 13.13,33.53 15.09,33.53 15.23,33.39 | 16.34,32.27 16.48,32.13 16.48,28.5 J2.2 | 16.34,32.27 15.23,33.39 | v15.37,33.53 15.23,33.39 | v40.51,30.73 36.32,30.73 32.97,34.09 27.66,34.09 25.98,32.41 16.48,32.41 16.34,32.27
  Bottom 0.406: v18.16,15.09 18.16,13.41 U4.20 | v15.37,33.53 14,34.9 R8.2 | v40.51,30.73 40.51,30.49 41.8,29.2 41.8,27.8 44.2,25.4 59,25.4 | IC5.5 55.78,29.6 57.6,29.6 59.4,27.8 59.4,25.8 59,25.4 | 59,25.4 58.8,25.2 v58.8,24.4
SERIALRESET
  Bottom 0.406: C2.2 36.6,39.4 36.6,42.75 SERIAL.4
STIN
  Bottom 0.406: IC6.2 47,33.6 47.2,33.4 47.2,31.45 R16.1 47.35,29.2 49,29.2 C11.1 R12.2
SW1
  Bottom 0.406: U4.16 21.23,13.13 21.23,10.06 17.04,5.87 15.09,5.87 S1.4 14.81,5.87 7.26,5.87 S1.3
TX  (via drill 0.35)
  Top 0.406: v16.8,23 20,23 24.8,18.2 v24.8,15.8
  Bottom 0.406: 26.26,15.65 U4.10 25.12,15.68 v24.8,15.8 | SERIAL.3 38.84,43.03 37.16,44.7 12.01,44.7 6.43,39.12 6.43,33.81 13.13,27.1 13.13,26.26 16.39,23 v16.8,23
UBATT
  Bottom 0.508: 1.96,38.46 U$1.P$1 0.95,37.45 0.95,20.05 1.4,19.6 3.2,19.6 3.4,19.4 IC1.2 IC1.4 3.6,15.86 C8.1 4,12.3 4,11.8 4.4,11.4 4.8,11.4 7,9.2 C13.+ | R9.2 5,2.75 5,6.4 7.1,8.5 C13.+ | C13.+ 7,9.3
UBMESS
  Bottom 0.406: U4.31 14.53,21.23 13.97,21.23 12.57,22.63 12.57,26.26 5.87,32.97 4.88,32.97 R10.1 2.74,35.12 R6.2
VOLTDEVFOOT
  Bottom 0.406: Q2.P3 2.75,29.77 R10.2
XTAL1
  Bottom 0.406: U4.8 26.54,17.32 27.94,17.32 29.34,15.93 29.9,15.93 Q1.OUT
XTAL2
  Bottom 0.406: U4.7 26.54,18.16 29.9,18.16 Q1.IN

### Text on the board
tNames: RST | Tx | Rx | - | + | - | HB-WDS100-C6-O-2, v2.0 | Stephan 4/21 - CC by-nc-sa
bNames: JLCJLCJLCJLC